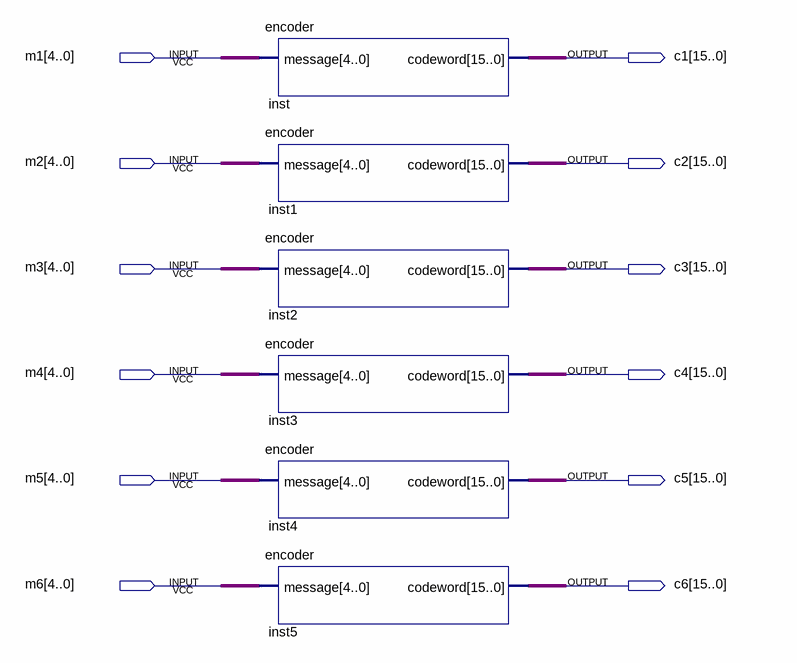
[diagram p0: schematic sheet]
// Quartus schematic parallel_encode.bdf as structural Verilog: 6 symbols, 12 pins
module parallel_encode (
  input  [4:0] m1,
  input  [4:0] m2,
  input  [4:0] m3,
  input  [4:0] m4,
  input  [4:0] m5,
  input  [4:0] m6,
  output [15:0] c1,
  output [15:0] c2,
  output [15:0] c3,
  output [15:0] c4,
  output [15:0] c5,
  output [15:0] c6
);

  encoder inst (.message(m1), .codeword(c1));
  encoder inst1 (.message(m2), .codeword(c2));
  encoder inst2 (.message(m3), .codeword(c3));
  encoder inst3 (.message(m4), .codeword(c4));
  encoder inst4 (.message(m5), .codeword(c5));
  encoder inst5 (.message(m6), .codeword(c6));
endmodule
